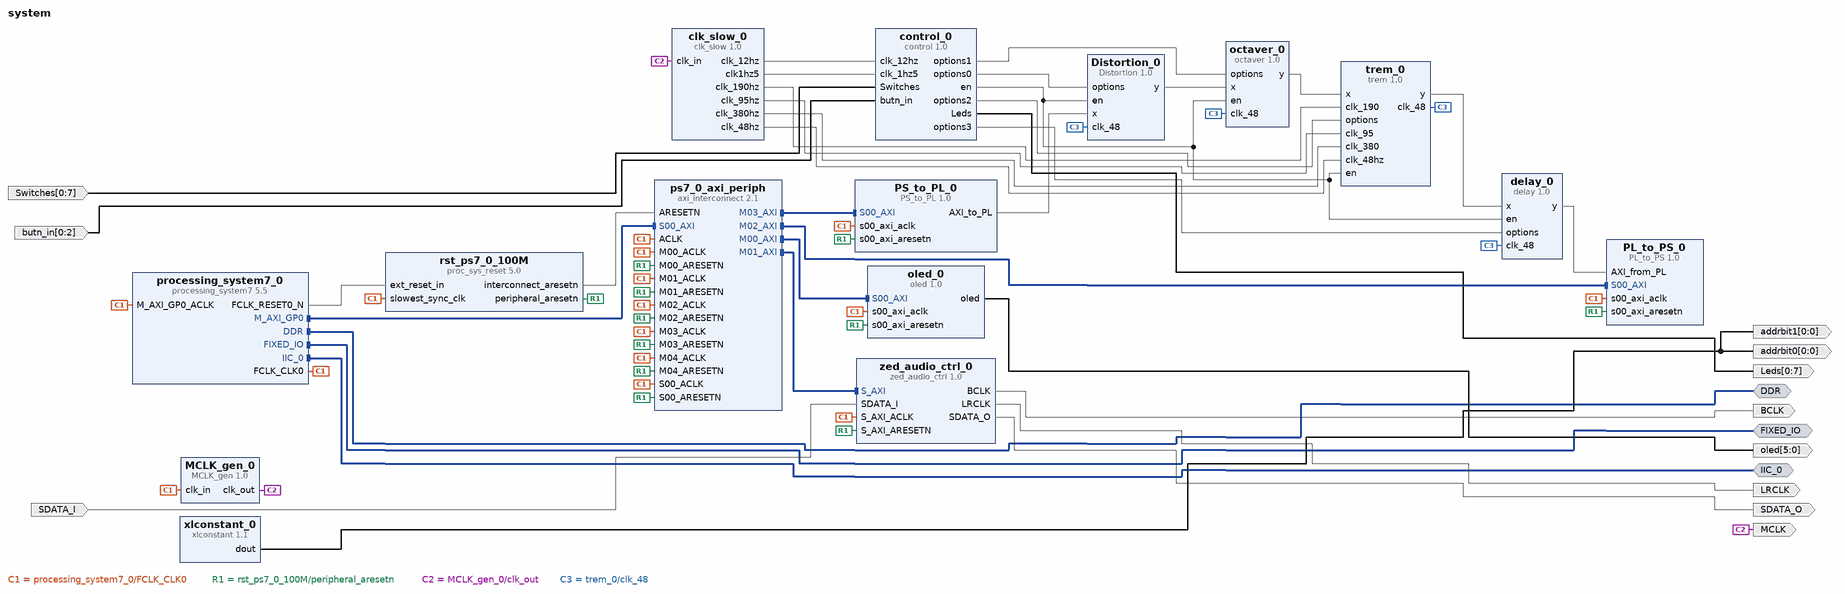
[diagram p0: block diagram of the top level]
# Vivado block design system, xc7z020clg484-1, Vivado 2018.2
create_bd_design system

create_bd_intf_port -mode Master -vlnv xilinx.com:interface:ddrx_rtl:1.0 DDR
create_bd_intf_port -mode Master -vlnv xilinx.com:display_processing_system7:fixedio_rtl:1.0 FIXED_IO
create_bd_intf_port -mode Master -vlnv xilinx.com:interface:iic_rtl:1.0 IIC_0
create_bd_port -dir O -from 5 -to 0 oled
create_bd_port -dir O BCLK
create_bd_port -dir O LRCLK
create_bd_port -dir O SDATA_O
create_bd_port -dir I SDATA_I
create_bd_port -dir O MCLK
create_bd_port -dir O -from 0 -to 0 addrbit0
create_bd_port -dir O -from 0 -to 0 addrbit1
create_bd_port -dir I -from 0 -to 7 Switches
create_bd_port -dir I -from 0 -to 2 butn_in
create_bd_port -dir O -from 0 -to 7 Leds

create_bd_cell -type ip -vlnv xilinx.com:ip:processing_system7:5.5 processing_system7_0
set_property -dict [list \
  CONFIG.PCW_UIPARAM_DDR_FREQ_MHZ 533.333313 \
  CONFIG.PCW_APU_PERIPHERAL_FREQMHZ 666.666667 \
  CONFIG.PCW_QSPI_PERIPHERAL_FREQMHZ 200.000000 \
  CONFIG.PCW_SDIO_PERIPHERAL_FREQMHZ 50 \
  CONFIG.PCW_UART_PERIPHERAL_FREQMHZ 50 \
  CONFIG.PCW_I2C_PERIPHERAL_FREQMHZ 111.111115 \
  CONFIG.PCW_FPGA0_PERIPHERAL_FREQMHZ 100.000000 \
  CONFIG.PCW_FPGA1_PERIPHERAL_FREQMHZ 150.000000 \
  CONFIG.PCW_FPGA2_PERIPHERAL_FREQMHZ 50.000000 \
  CONFIG.PCW_PRESET_BANK1_VOLTAGE {LVCMOS 1.8V} \
  CONFIG.PCW_UIPARAM_DDR_PARTNO {MT41J128M16 HA-15E} \
  CONFIG.PCW_QSPI_PERIPHERAL_ENABLE 1 \
  CONFIG.PCW_QSPI_QSPI_IO {MIO 1 .. 6} \
  CONFIG.PCW_QSPI_GRP_SINGLE_SS_ENABLE 1 \
  CONFIG.PCW_QSPI_GRP_SINGLE_SS_IO {MIO 1 .. 6} \
  CONFIG.PCW_SINGLE_QSPI_DATA_MODE x4 \
  CONFIG.PCW_ENET0_PERIPHERAL_ENABLE 1 \
  CONFIG.PCW_ENET0_ENET0_IO {MIO 16 .. 27} \
  CONFIG.PCW_ENET0_GRP_MDIO_ENABLE 1 \
  CONFIG.PCW_ENET0_GRP_MDIO_IO {MIO 52 .. 53} \
  CONFIG.PCW_ENET_RESET_ENABLE 1 \
  CONFIG.PCW_ENET_RESET_SELECT {Share reset pin} \
  CONFIG.PCW_ENET0_RESET_ENABLE 0 \
  CONFIG.PCW_SD0_PERIPHERAL_ENABLE 1 \
  CONFIG.PCW_SD0_SD0_IO {MIO 40 .. 45} \
  CONFIG.PCW_SD0_GRP_CD_ENABLE 1 \
  CONFIG.PCW_SD0_GRP_CD_IO {MIO 47} \
  CONFIG.PCW_SD0_GRP_WP_ENABLE 1 \
  CONFIG.PCW_SD0_GRP_WP_IO {MIO 46} \
  CONFIG.PCW_UART1_PERIPHERAL_ENABLE 1 \
  CONFIG.PCW_UART1_UART1_IO {MIO 48 .. 49} \
  CONFIG.PCW_TTC0_PERIPHERAL_ENABLE 1 \
  CONFIG.PCW_TTC0_TTC0_IO EMIO \
  CONFIG.PCW_USB0_PERIPHERAL_ENABLE 1 \
  CONFIG.PCW_USB0_USB0_IO {MIO 28 .. 39} \
  CONFIG.PCW_USB_RESET_ENABLE 1 \
  CONFIG.PCW_USB_RESET_SELECT {Share reset pin} \
  CONFIG.PCW_USB0_RESET_ENABLE 0 \
  CONFIG.PCW_I2C0_PERIPHERAL_ENABLE 1 \
  CONFIG.PCW_I2C0_I2C0_IO EMIO \
  CONFIG.PCW_I2C_RESET_ENABLE 1 \
  CONFIG.PCW_I2C_RESET_SELECT {Share reset pin} \
  CONFIG.PCW_GPIO_MIO_GPIO_ENABLE 1 \
  CONFIG.PCW_GPIO_MIO_GPIO_IO MIO \
  CONFIG.preset ZedBoard \
] [get_bd_cells processing_system7_0]
# 223 more settings of processing_system7_0 are not shown: defaults, MIO pin electricals, DDR timing, and values the tool derives
create_bd_cell -type ip -vlnv xilinx.com:user:oled:1.0 oled_0
create_bd_cell -type ip -vlnv xilinx.com:user:zed_audio_ctrl:1.0 zed_audio_ctrl_0
create_bd_cell -type ip -vlnv VL:user:MCLK_gen:1.0 MCLK_gen_0
create_bd_cell -type ip -vlnv xilinx.com:ip:axi_interconnect:2.1 ps7_0_axi_periph
set_property -dict {CONFIG.NUM_MI 5} [get_bd_cells ps7_0_axi_periph]
create_bd_cell -type ip -vlnv xilinx.com:ip:proc_sys_reset:5.0 rst_ps7_0_100M
create_bd_cell -type ip -vlnv xilinx.com:ip:xlconstant:1.1 xlconstant_0
set_property -dict {CONFIG.CONST_VAL 0} [get_bd_cells xlconstant_0]
create_bd_cell -type ip -vlnv VL:user:control:1.0 control_0
create_bd_cell -type ip -vlnv VL:user:clk_slow:1.0 clk_slow_0
create_bd_cell -type ip -vlnv VL:user:Distortion:1.0 Distortion_0
create_bd_cell -type ip -vlnv VL:user:octaver:1.0 octaver_0
create_bd_cell -type ip -vlnv VL:user:trem:1.0 trem_0
create_bd_cell -type ip -vlnv VL:user:delay:1.0 delay_0
create_bd_cell -type ip -vlnv VL:user:PL_to_PS:1.0 PL_to_PS_0
create_bd_cell -type ip -vlnv VL:user:PS_to_PL:1.0 PS_to_PL_0

# ---- connections ----

connect_bd_intf_net [get_bd_intf_pins processing_system7_0/M_AXI_GP0] [get_bd_intf_pins ps7_0_axi_periph/S00_AXI]
connect_bd_intf_net [get_bd_intf_pins ps7_0_axi_periph/M00_AXI] [get_bd_intf_pins oled_0/S00_AXI]
connect_bd_intf_net [get_bd_intf_pins ps7_0_axi_periph/M01_AXI] [get_bd_intf_pins zed_audio_ctrl_0/S_AXI]
connect_bd_intf_net [get_bd_intf_pins PL_to_PS_0/S00_AXI] [get_bd_intf_pins ps7_0_axi_periph/M02_AXI]
connect_bd_intf_net [get_bd_intf_pins PS_to_PL_0/S00_AXI] [get_bd_intf_pins ps7_0_axi_periph/M03_AXI]
connect_bd_intf_net [get_bd_intf_ports DDR] [get_bd_intf_pins processing_system7_0/DDR]
connect_bd_intf_net [get_bd_intf_ports FIXED_IO] [get_bd_intf_pins processing_system7_0/FIXED_IO]
connect_bd_intf_net [get_bd_intf_ports IIC_0] [get_bd_intf_pins processing_system7_0/IIC_0]
connect_bd_net [get_bd_pins processing_system7_0/FCLK_CLK0] \
  [get_bd_pins processing_system7_0/M_AXI_GP0_ACLK] [get_bd_pins rst_ps7_0_100M/slowest_sync_clk] \
  [get_bd_pins oled_0/s00_axi_aclk] [get_bd_pins zed_audio_ctrl_0/S_AXI_ACLK] [get_bd_pins MCLK_gen_0/clk_in] \
  [get_bd_pins ps7_0_axi_periph/S00_ACLK] [get_bd_pins ps7_0_axi_periph/M00_ACLK] [get_bd_pins ps7_0_axi_periph/ACLK] \
  [get_bd_pins ps7_0_axi_periph/M01_ACLK] [get_bd_pins ps7_0_axi_periph/M02_ACLK] [get_bd_pins ps7_0_axi_periph/M03_ACLK] \
  [get_bd_pins ps7_0_axi_periph/M04_ACLK] [get_bd_pins PL_to_PS_0/s00_axi_aclk] [get_bd_pins PS_to_PL_0/s00_axi_aclk]
connect_bd_net [get_bd_pins processing_system7_0/FCLK_RESET0_N] [get_bd_pins rst_ps7_0_100M/ext_reset_in]
connect_bd_net [get_bd_pins rst_ps7_0_100M/peripheral_aresetn] \
  [get_bd_pins oled_0/s00_axi_aresetn] [get_bd_pins zed_audio_ctrl_0/S_AXI_ARESETN] \
  [get_bd_pins ps7_0_axi_periph/S00_ARESETN] [get_bd_pins ps7_0_axi_periph/M00_ARESETN] \
  [get_bd_pins ps7_0_axi_periph/M01_ARESETN] [get_bd_pins ps7_0_axi_periph/M02_ARESETN] \
  [get_bd_pins ps7_0_axi_periph/M03_ARESETN] [get_bd_pins ps7_0_axi_periph/M04_ARESETN] \
  [get_bd_pins PL_to_PS_0/s00_axi_aresetn] [get_bd_pins PS_to_PL_0/s00_axi_aresetn]
connect_bd_net [get_bd_pins rst_ps7_0_100M/interconnect_aresetn] [get_bd_pins ps7_0_axi_periph/ARESETN]
connect_bd_net [get_bd_pins oled_0/oled] [get_bd_ports oled]
connect_bd_net [get_bd_pins zed_audio_ctrl_0/BCLK] [get_bd_ports BCLK]
connect_bd_net [get_bd_pins zed_audio_ctrl_0/LRCLK] [get_bd_ports LRCLK]
connect_bd_net [get_bd_pins zed_audio_ctrl_0/SDATA_O] [get_bd_ports SDATA_O]
connect_bd_net -net SDATA_I_0_1 [get_bd_ports SDATA_I] [get_bd_pins zed_audio_ctrl_0/SDATA_I]
connect_bd_net [get_bd_pins MCLK_gen_0/clk_out] [get_bd_ports MCLK] [get_bd_pins clk_slow_0/clk_in]
connect_bd_net [get_bd_pins xlconstant_0/dout] [get_bd_ports addrbit1] [get_bd_ports addrbit0]
connect_bd_net -net Switches_0_1 [get_bd_ports Switches] [get_bd_pins control_0/Switches]
connect_bd_net -net butn_in_0_1 [get_bd_ports butn_in] [get_bd_pins control_0/butn_in]
connect_bd_net [get_bd_pins control_0/Leds] [get_bd_ports Leds]
connect_bd_net [get_bd_pins clk_slow_0/clk_190hz] [get_bd_pins trem_0/clk_190]
connect_bd_net [get_bd_pins clk_slow_0/clk_95hz] [get_bd_pins trem_0/clk_95]
connect_bd_net [get_bd_pins clk_slow_0/clk_12hz] [get_bd_pins control_0/clk_12hz]
connect_bd_net [get_bd_pins clk_slow_0/clk_380hz] [get_bd_pins trem_0/clk_380]
connect_bd_net [get_bd_pins clk_slow_0/clk1hz5] [get_bd_pins control_0/clk_1hz5]
connect_bd_net [get_bd_pins clk_slow_0/clk_48hz] [get_bd_pins trem_0/clk_48hz]
connect_bd_net [get_bd_pins octaver_0/y] [get_bd_pins trem_0/x]
connect_bd_net [get_bd_pins control_0/options2] [get_bd_pins trem_0/options]
connect_bd_net [get_bd_pins trem_0/y] [get_bd_pins delay_0/x]
connect_bd_net [get_bd_pins delay_0/y] [get_bd_pins PL_to_PS_0/AXI_from_PL]
connect_bd_net [get_bd_pins PS_to_PL_0/AXI_to_PL] [get_bd_pins Distortion_0/x]
connect_bd_net [get_bd_pins control_0/options0] [get_bd_pins Distortion_0/options]
connect_bd_net [get_bd_pins control_0/options1] [get_bd_pins octaver_0/options]
connect_bd_net [get_bd_pins Distortion_0/y] [get_bd_pins octaver_0/x]
connect_bd_net [get_bd_pins control_0/en] [get_bd_pins octaver_0/en] [get_bd_pins Distortion_0/en] [get_bd_pins trem_0/en] [get_bd_pins delay_0/en]
connect_bd_net [get_bd_pins trem_0/clk_48] [get_bd_pins delay_0/clk_48] [get_bd_pins octaver_0/clk_48] [get_bd_pins Distortion_0/clk_48]
connect_bd_net [get_bd_pins control_0/options3] [get_bd_pins delay_0/options]

# ---- address map ----
assign_bd_address -offset 0x43C00000 -range 64K -target_address_space [get_bd_addr_spaces processing_system7_0/Data] [get_bd_addr_segs oled_0/S00_AXI/S00_AXI_reg]
assign_bd_address -offset 0x43C10000 -range 64K -target_address_space [get_bd_addr_spaces processing_system7_0/Data] [get_bd_addr_segs zed_audio_ctrl_0/S_AXI/reg0]
assign_bd_address -offset 0x43C20000 -range 64K -target_address_space [get_bd_addr_spaces processing_system7_0/Data] [get_bd_addr_segs PL_to_PS_0/S00_AXI/S00_AXI_reg]
assign_bd_address -offset 0x43C30000 -range 64K -target_address_space [get_bd_addr_spaces processing_system7_0/Data] [get_bd_addr_segs PS_to_PL_0/S00_AXI/S00_AXI_reg]

validate_bd_design
save_bd_design
